# Altium schematic sheet Fri3D_2018_00.SchDoc: Fri3D Badge 2018
size A3; Date: 22/05/2017; DrawnBy: Wim Van Gool; DocumentNumber: 1; Revision: 00; SheetNumber: 1; SheetTotal: 4
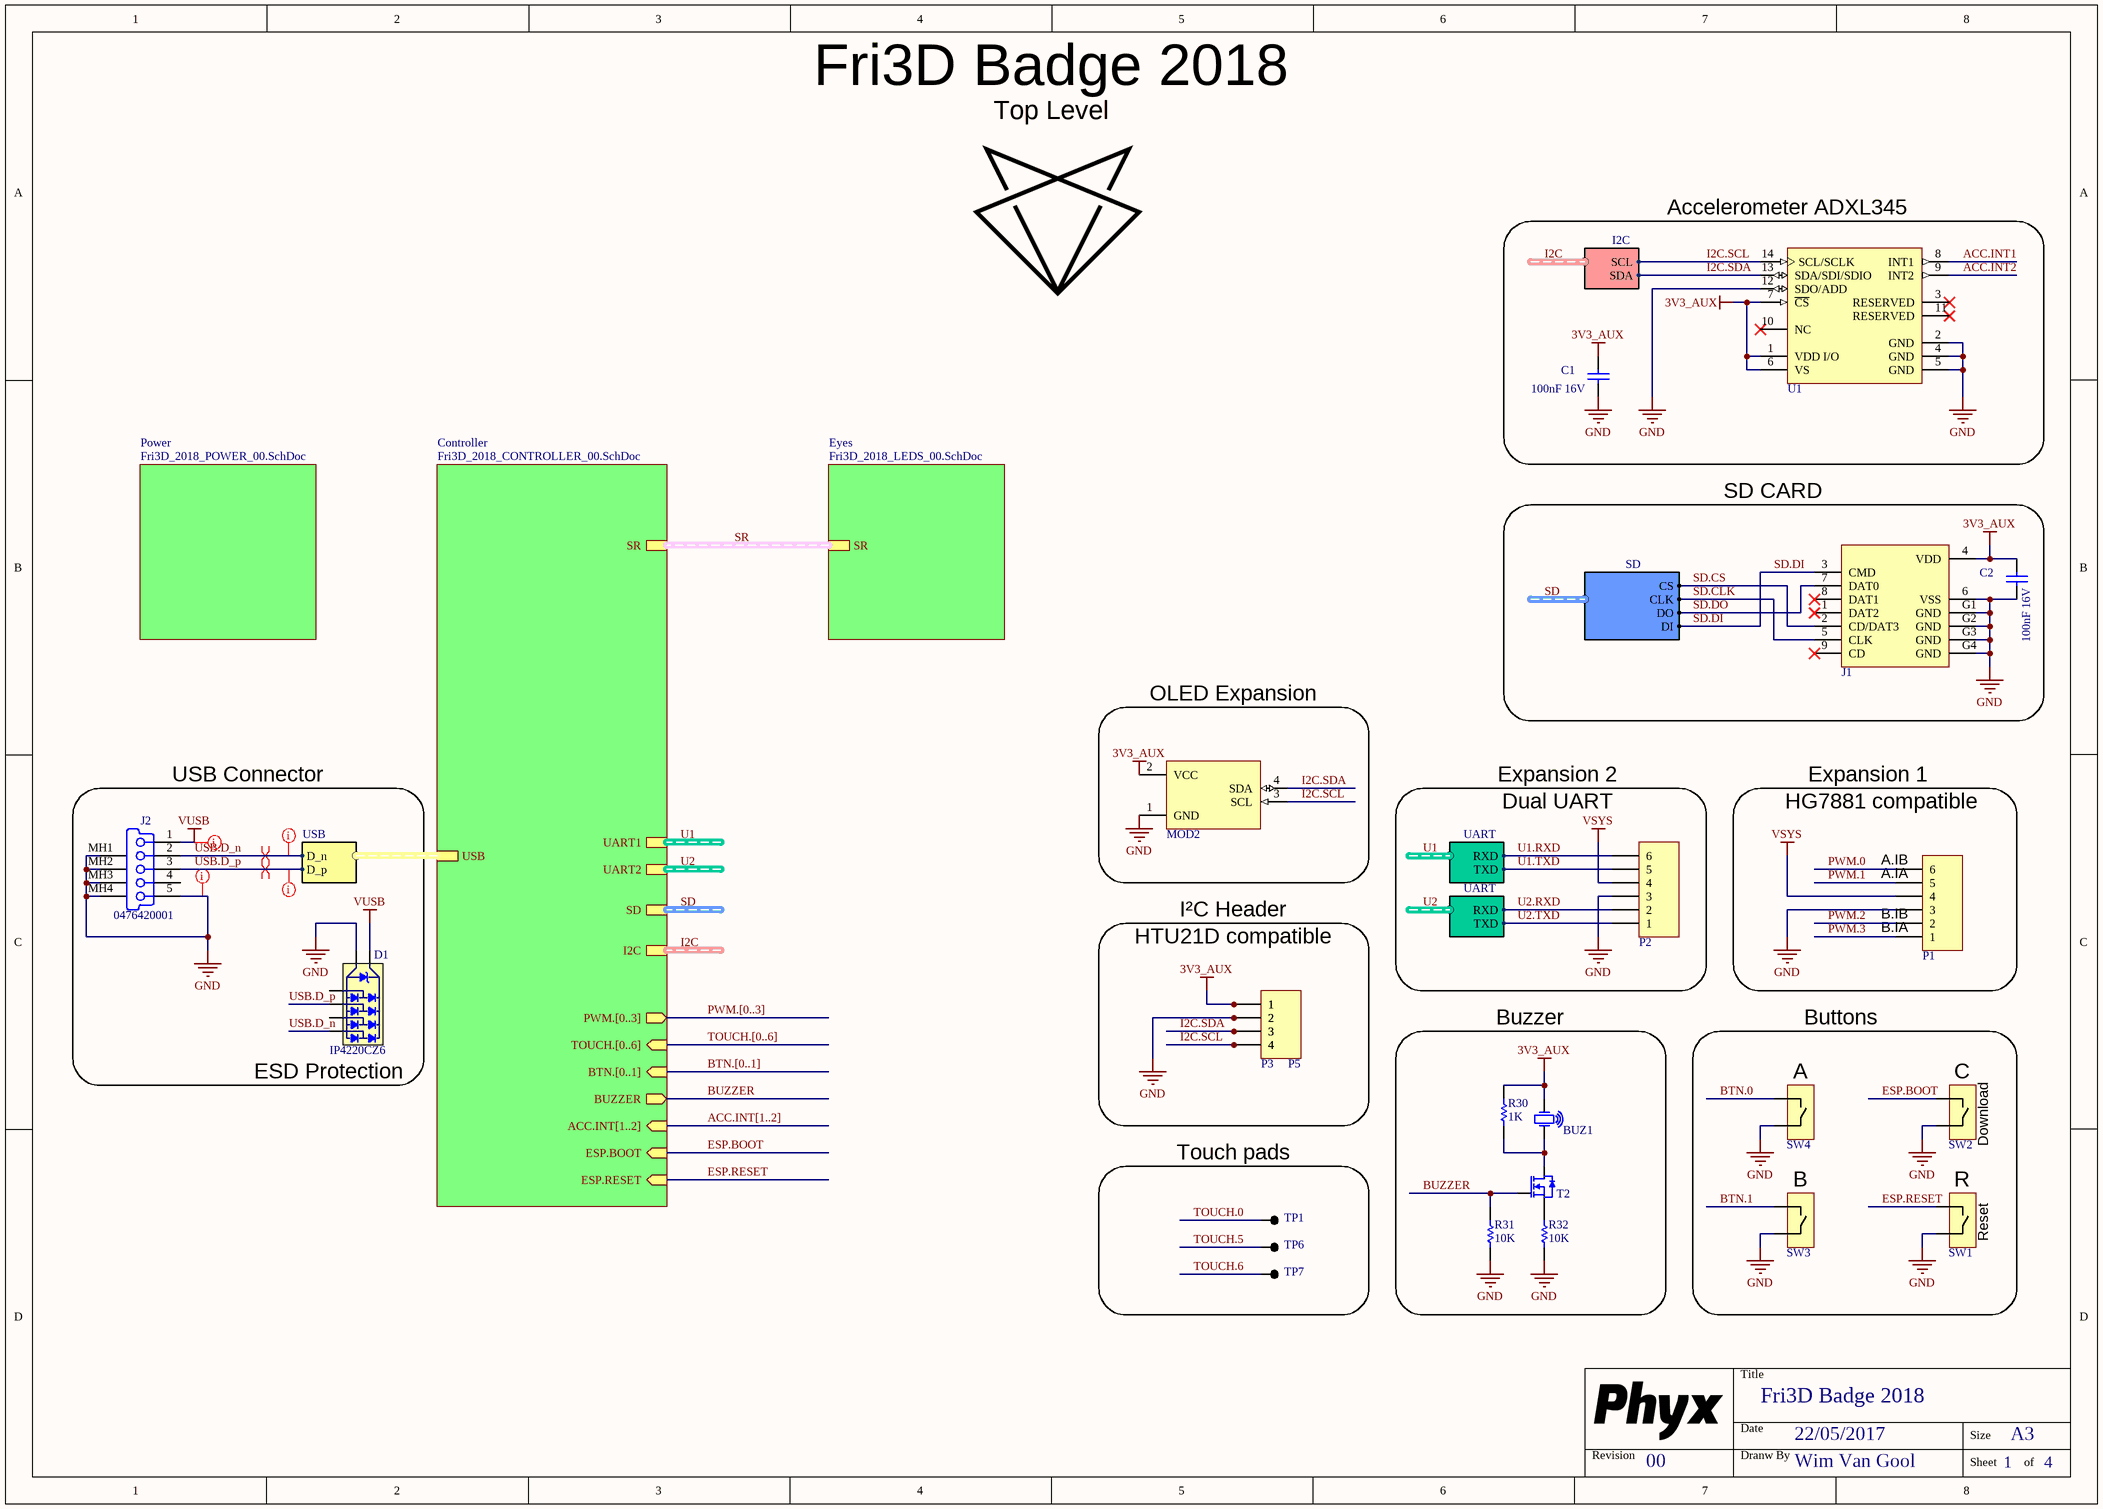
[diagram p0: Fri3D_2018_00.SchDoc]

## Parts
BUZ1  12x12x3mm Piezo Buzzer Transducer 81dB  [CUI_CMT-1203-SMT]  (value not drawn)
C1  value 100nF 16V  [C0603_N]
C2  value 100nF 16V  [C0603_N]
D1  value IP4220CZ6  [NXP_SOT457]  (hidden comment: TVS Diode Dual USB)
J1  Micro SD PiPo Push-Push  [TFP09-2-12B]  (value not drawn)
J2  value 0476420001  [MLX_0476420001]  (hidden comment: Molex 0476420001)
MOD2  SSD1306 based 128x64 OLED, I2C, module  [OLED_MOD_0.96_I2C]  (value not drawn)
P1  Header 6  [HDR1X6]  (value not drawn)
P2  Header 6  [HDR1X6]  (value not drawn)
P3  Header 4  [HDR1X4]  (value not drawn)
P5  Header 4  [HDR1X4]  (value not drawn)
R30  value 1K  [R0603_N]
R31  value 10K  [R0603_N]  (hidden comment: RESISTOR)
R32  value 10K  [R0603_N]  (hidden comment: RESISTOR)
SW1  4.5x4.5mm tact SMD H3,8mm  [WE_430181038816]  (value not drawn)
SW2  4.5x4.5mm tact SMD H3,8mm  [WE_430181038816]  (value not drawn)
SW3  4.5x4.5mm tact SMD H3,8mm  [WE_430181038816]  (value not drawn)
SW4  4.5x4.5mm tact SMD H3,8mm  [WE_430181038816]  (value not drawn)
T2  0.2A N-Ch MOSFET Vgs 3.2  [SOT23-3]  (value not drawn)
TP1  TEST_PAD  [TP_0.8mm]  (value not drawn)
TP6  TEST_PAD  [TP_0.8mm]  (value not drawn)
TP7  TEST_PAD  [TP_0.8mm]  (value not drawn)
U1  3-Axis, ±2 g/±4 g/±8 g/±16 g Digital Accelerometer  [AD_CC-14-1]  (value not drawn)

## Blocks framed on the sheet
Accelerometer ADXL345: C1 U1
SD CARD: C2 J1
OLED Expansion: MOD2
Buzzer: BUZ1 R30-R32 T2
Touch pads: TP1 TP6 TP7

## Sub-sheets
Controller = Fri3D_2018_CONTROLLER_00.SchDoc: SR (harness Shift Register), USB (harness USB), PWM.[0..3] (out), I2C (harness I2C), SD (harness SD), TOUCH.[0..6] (in), BUZZER (out), BTN.[0..1] (in), ACC.INT[1..2] (in), ESP.RESET (in), UART2 (harness UART), UART1 (harness UART), ESP.BOOT (in)
Eyes = Fri3D_2018_LEDS_00.SchDoc: SR (harness Shift Register)
Power = Fri3D_2018_POWER_00.SchDoc: no entries

## Harnesses
USB: D_p, D_n
I2C: SDA, SCL
SD: CS, CLK, DO, DI
UART: TXD, RXD

## Nets
3V3_AUX: BUZ1.1(OSC1) C1.1 C2.1 J1.4(VDD) MOD2.2(VCC) P3.1 P5.1 R30.1 U1.1(VDD_I/O) U1.6(VS) U1.7(~{CS})
GND: C1.2 C2.2 D1.2(GND) J1.6(VSS) J1.G1(GND) J1.G2(GND) J1.G3(GND) J1.G4(GND) J2.5(GND) J2.MH1(Tab) J2.MH2(Tab) J2.MH3(Tab) J2.MH4(Tab) MOD2.1(GND) P1.3 P2.3 P3.2 P5.2 R31.2 R32.2 SW1.2 SW2.2 SW3.2 SW4.2 U1.2(GND) U1.4(GND) U1.5(GND) U1.12(SDO/ADD)
VSYS: P1.4 P2.4
VUSB: D1.5(VBus) J2.1(V_BUS_(5V))
ACC.INT1: U1.8(INT1)
ACC.INT2: U1.9(INT2)
BTN.0: SW4.1
BTN.1: SW3.1
BUZZER: R31.1 T2.1(G) ; sheet Controller/BUZZER
ESP.BOOT: SW2.1 ; sheet Controller/ESP.BOOT
ESP.RESET: SW1.1 ; sheet Controller/ESP.RESET
I2C.SCL: MOD2.3(SCL) P3.4 P5.4 U1.14(SCL/SCLK) ; sheet Controller/I2C.SCL
I2C.SDA: MOD2.4(SDA) P3.3 P5.3 U1.13(SDA/SDI/SDIO) ; sheet Controller/I2C.SDA
PWM.0: P1.6
PWM.1: P1.5
PWM.2: P1.2
PWM.3: P1.1
SD.CLK: J1.5(CLK) ; sheet Controller/SD.CLK
SD.CS: J1.2(CD/DAT3) ; sheet Controller/SD.CS
SD.DI: J1.3(CMD) ; sheet Controller/SD.DI
SD.DO: J1.7(DAT0) ; sheet Controller/SD.DO
TOUCH.0: TP1.1
TOUCH.5: TP6.1
TOUCH.6: TP7.1
U1.RXD: P2.6 ; sheet Controller/UART1.RXD
U1.TXD: P2.5 ; sheet Controller/UART1.TXD
U2.RXD: P2.2 ; sheet Controller/UART2.RXD
U2.TXD: P2.1 ; sheet Controller/UART2.TXD
USB.D_n: D1.6 J2.2(D-) ; sheet Controller/USB.D_n
USB.D_p: D1.1 J2.3(D+) ; sheet Controller/USB.D_p
NetBUZ1_2: BUZ1.2(OSC2) R30.2 T2.3(D)
NetR32_1: R32.1 T2.2(S)

Not connected (* = marked no-connect by the designer): D1 3 4; J1 1(DAT2)* 8(DAT1)* 9(CD)*; J2 4(NC); U1 3(RESERVED)* 10(NC)* 11(RESERVED)*

## Buses and harness runs
bus ACC.INT[1..2] = sheet Controller/ACC.INT[1..2]
bus BTN.[0..1] = sheet Controller/BTN.[0..1]
bus PWM.[0..3] = sheet Controller/PWM.[0..3]
bus TOUCH.[0..6] = sheet Controller/TOUCH.[0..6]
harness I2C = sheet Controller/I2C
harness SD = sheet Controller/SD
harness SR = sheet Controller/SR = sheet Eyes/SR
harness U1 = sheet Controller/UART1
harness U2 = sheet Controller/UART2

## Layout directives
net class POWER: GND, VUSB
net class 90r: USB.D_n, USB.D_p
differential pair: USB.D_n, USB.D_p

## Notes on the sheet
- Fri3D Badge 2018
- Top Level
- USB Connector
- Expansion 2
- Expansion 1
- (near P2) Dual UART
- HG7881 compatible
- I²C Header
- (near P1) A.IB
- (near P1) A.IA
- (near P1) B.IB
- HTU21D compatible
- (near P1) B.IA
- Buttons
- (near D1) ESD Protection
- (near SW4) A
- (near SW2) C
- (near SW2) Download
- (near SW3) B
- (near SW1) R
- (near SW1) Reset
- Title
- Revision
- Date
- Dranw By
- Size
- A3
- Sheet
- of

## Library data of the parts
BUZ1 = BUZ # CUI CMT-1203-SMT: Crystal Oscillator; Value: CMT-1203-SMT; Supplier 1: Digikey; Supplier Part Number 1: 102-2197-1-ND; Supplier 2: Aliexpress; Supplier Part Number 2: KLJ-1230
C1 C2 = CAP # 100nF 16V 0603: Capacitor Ceramic
D1 = TVS # IP4220CZ6 Dual USB: =Description; Supplier 1: Farnell; Supplier Part Number 1: 2143248
J1 = MicroSD TFP09-2-12B Push-Push: =Description; Value: TFP09-2-12B; Supplier 1: AliExpress; Supplier Part Number 1: TFP09-2-12B
J2 = USB # Micro B in-board Molex 0476420001: Supplier 1: Digikey; Supplier Part Number 1: WM1398TR-ND; Supplier 2: Aliexpress; Supplier Part Number 2: Micro USB M033
MOD2 = OLED MOD SSD1306 0.96in I2C 128x64: Value: 128x64 I2C OLED; Supplier 1: Aliexpress
P1 P2 = Pin Header 2.54mm 6way
P3 P5 = Pin Header 2.54mm 4way
R30 = RES # 1K 0603
R31 R32 = RES # 10K 0603: Supplier 1: Farnell; Supplier Part Number 1: 2502397
SW1-SW4 = SW # TACT small 4.5x4.5mm SMD WS-TASV: Value: 430181038816; Supplier 1: Wurth; Supplier Part Number 1: 430181038816
T2 = BSS138 N-Ch MOSFET 0.2A 3.2Vgs 60Vds: Value: BSS138; Supplier 1: Farnell; Supplier Part Number 1: 2432717
TP1 TP6 TP7 = TP # 0.8mm: Value: NO BOM
U1 = ACCELERO # ADXL345: =Description; Value: ADXL345BCCZ; Supplier 1: Farnell; Supplier Part Number 1: 1853935; Supplier 2: Digikey; Supplier Part Number 2: ADXL345BCCZ-ND